# EasyEDA Pro project PCB_PCB_aire_2023-10-16.eprj

# Board PCB_PCB_aire_2023-10-16
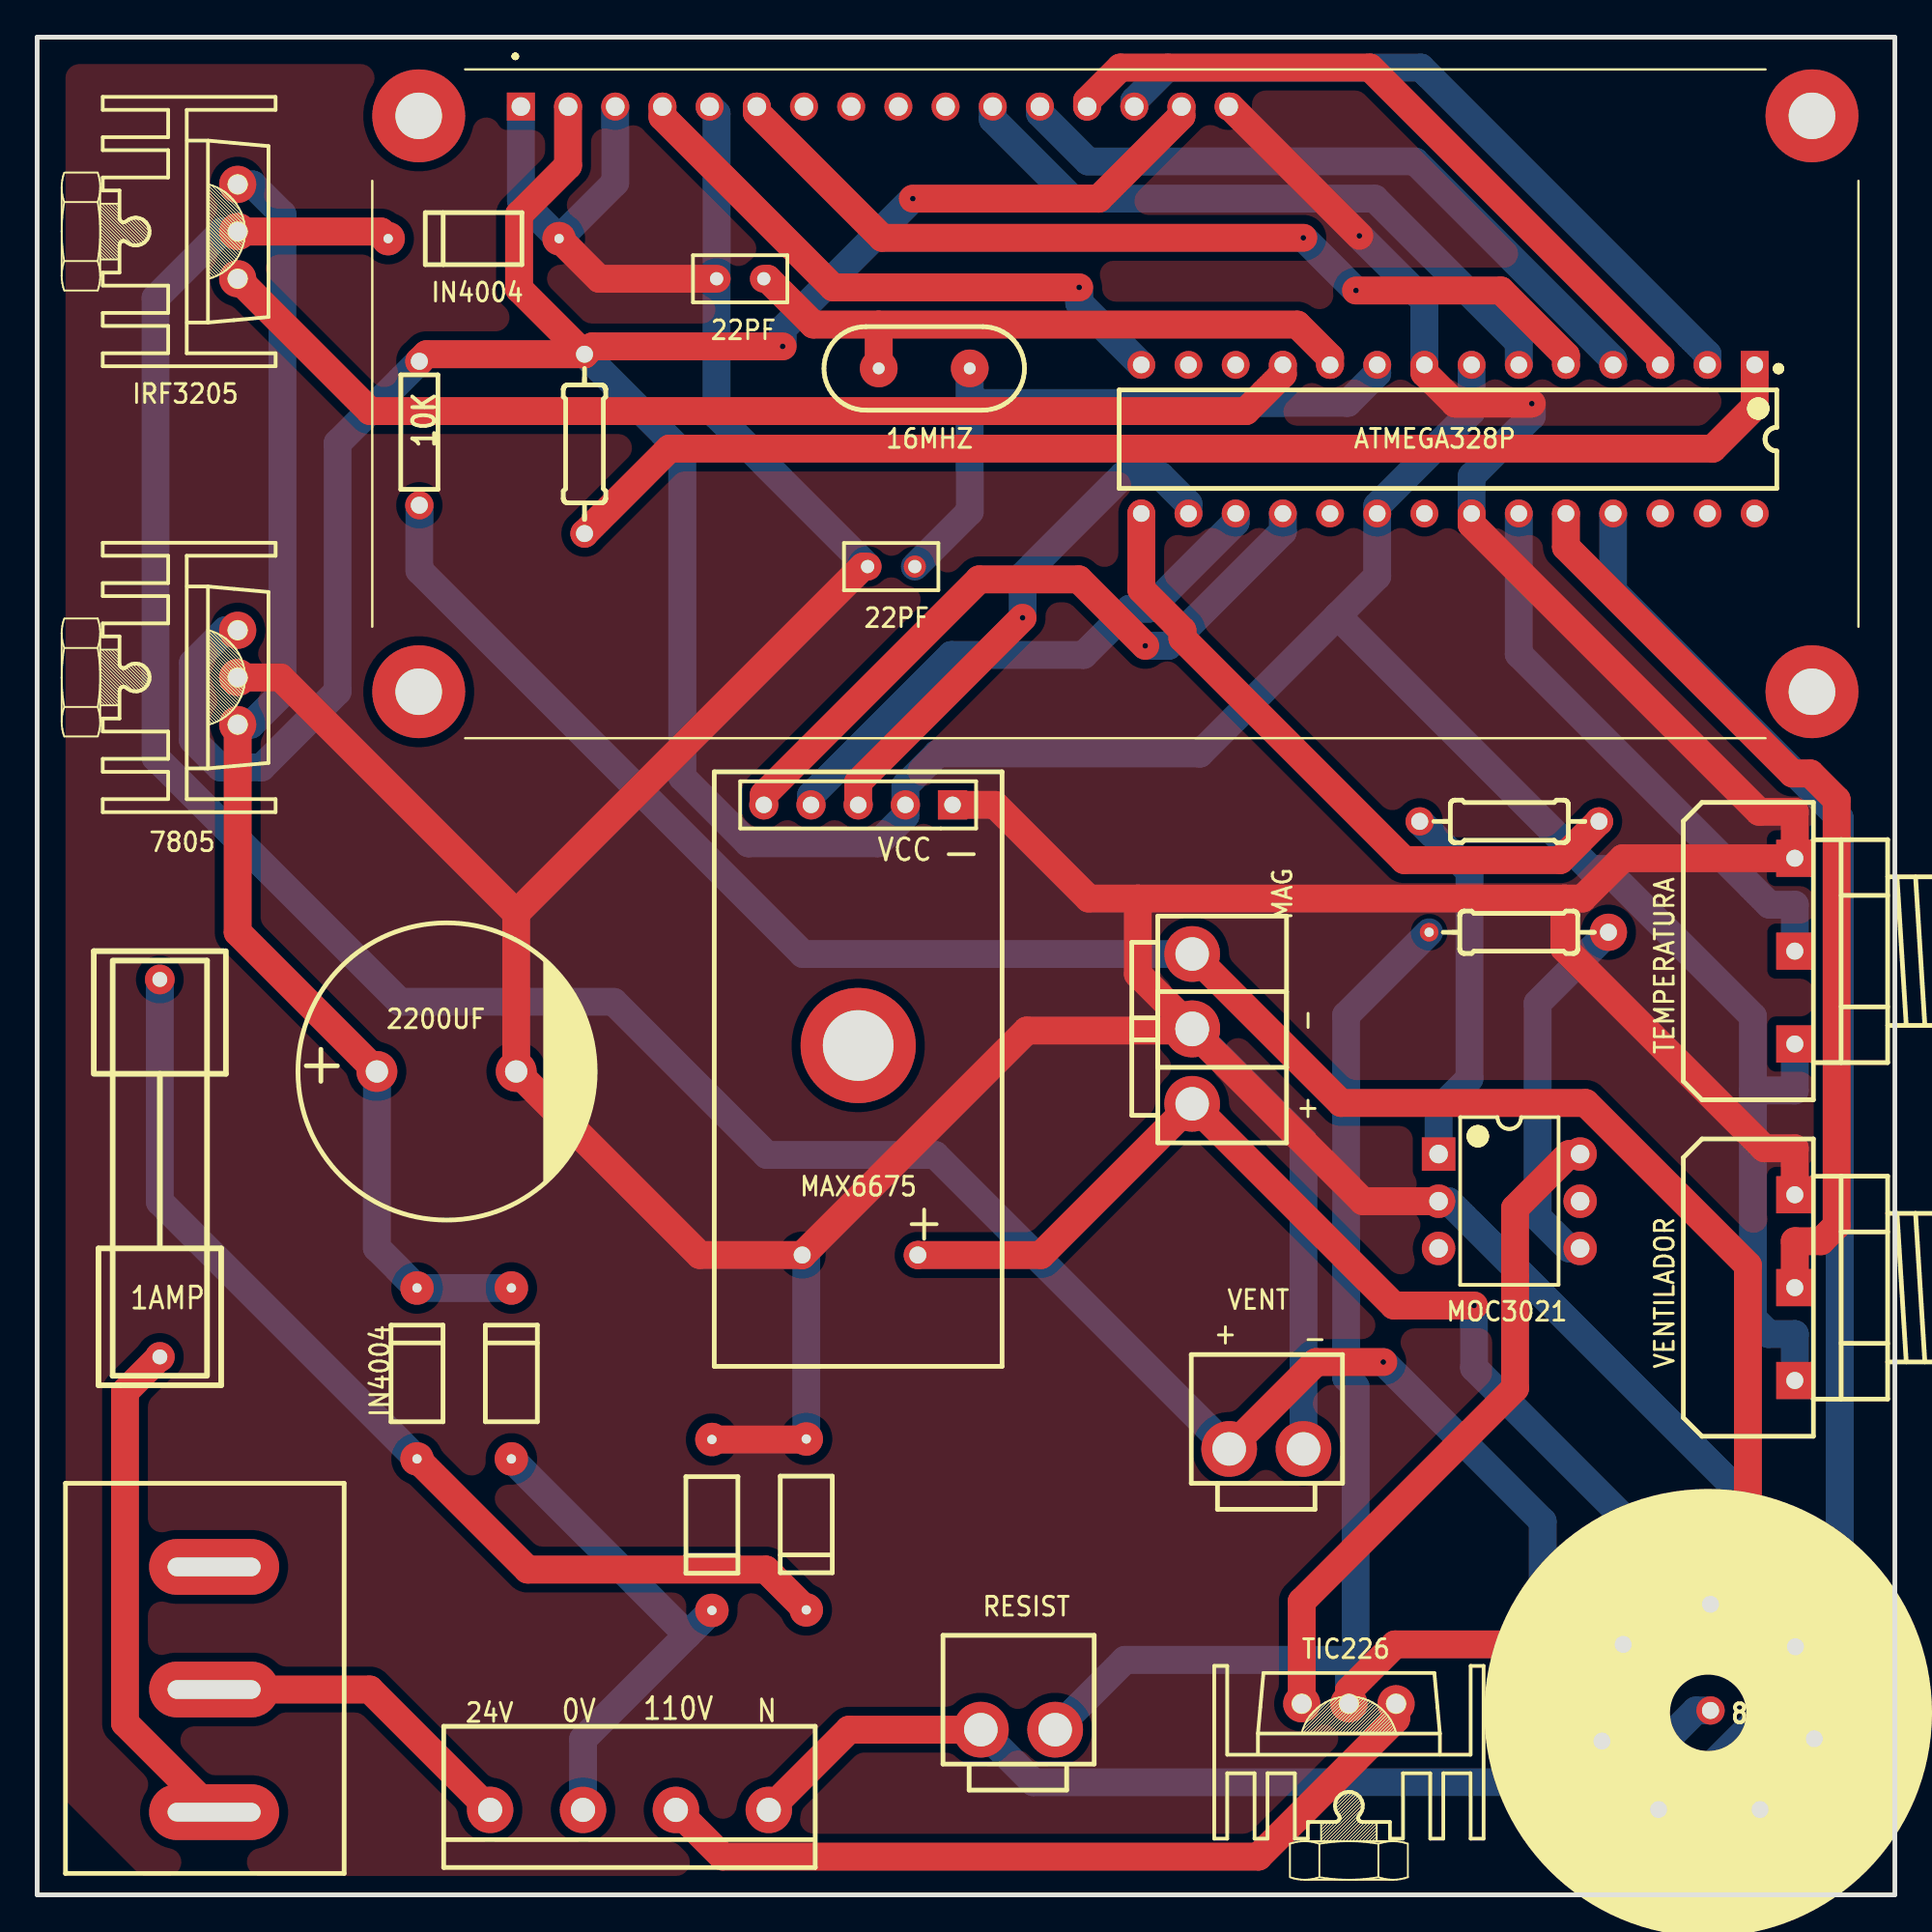
[diagram p0: board, top side]
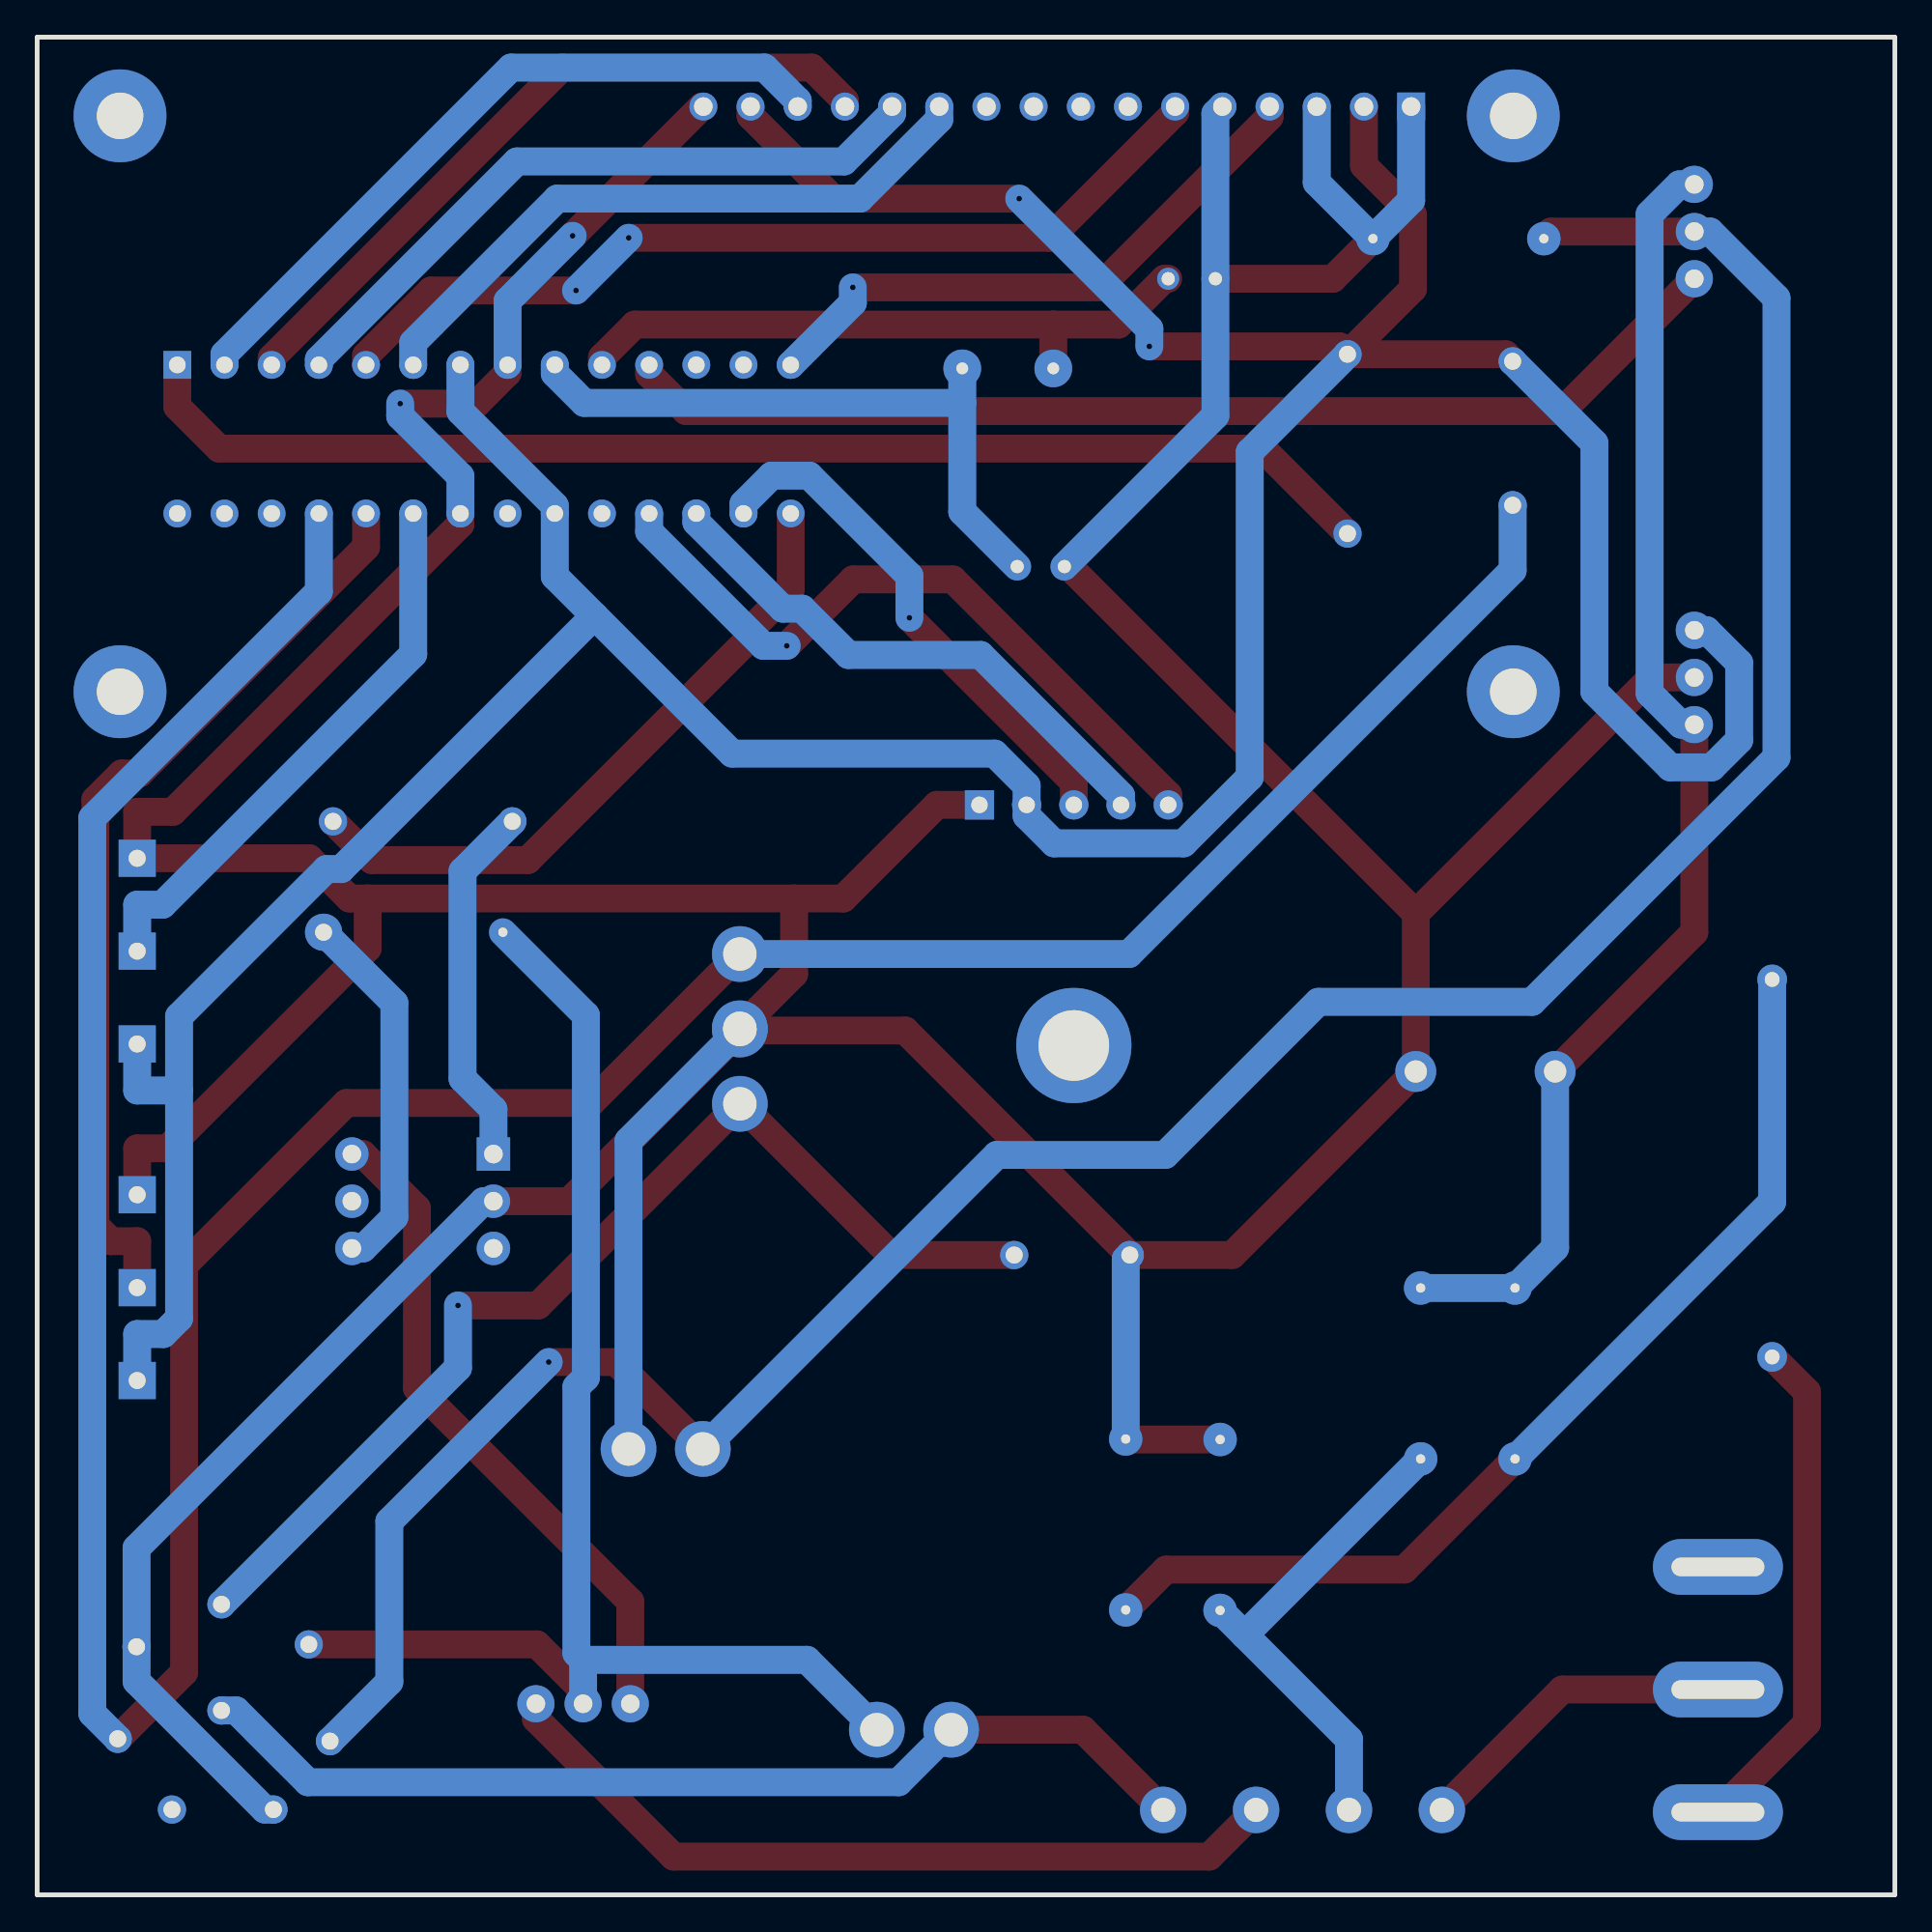
[diagram p1: board, bottom side, seen from below]

Outline 100 x 100 mm; copper layers: Top Layer, Bottom Layer. Coordinates in mm from the lower left corner of the outline.
Outline path: 0,100 100,100 100,0 0,0 0,100
Stack: Top Layer 0.035mm / Dielectric1 1.51mm FR4 er 4.5 / Bottom Layer 0.035mm

## Design rules (mm)
spacing Default (default): track to track 0.5, other pairs 0 to 0.5
track width Default (default): min 1.5, default 1.5, max 25.4
differential pair differentialPair (default): width min 0.127, default 0.254, max 2.54; gap min 0.152, default 0.152
via Default (default): diameter min 0.61, default 0.61, max 100.025; hole min 0.305, default 0.305, max 59.995

## Placement (name value [footprint] x y rotation side)
10K  -  [RESISTENCIA 10K]  20.57 78.74 270 top
16MHZ  -  [16MHZ_OSC [PCB]]  47.75 82.17 270 top
22PF  -  [RAD-0.1]  45.97 71.5 0 top
22PF#2  -  [RAD-0.1]  37.85 87 0 top
24V  -  [BORNERA 4P]  24.38 4.57 0 top
2200UF  -  [CAP-TH_BD16.0-P7.50-D1.2-FD]  22.04 44.32 0 top
7805  -  [IRF530 + DISIPADOR]  10.8 65.53 90 top
ATMEGA328P  -  [DIP-28_L34.6-W7.3-P2.54-LS10.2-BL]  75.95 78.36 180 top
D8  -  [LK D14007]  25.53 28.07 270 top
D13  -  [LK D14007]  36.32 19.91 90 top
F1  -  [PORTAFUSIBLE]  6.6 28.19 90 top
IN4004  -  [LK D14007]  20.45 28.07 270 top
IN4004#2  -  [LK D14007]  23.5 89.15 0 top
IN4005  -  [LK D14007]  41.4 19.94 90 top
IRF3205  -  [IRF530 + DISIPADOR]  10.8 89.53 90 top
MAG  -  [CONN-TH_2P-P4.00_VH2-HEADER2]  62.17 48.64 270 top
MAX6675  -  [MAX6675-MODULE]  41.66 40.89 270 top
MOC3021  -  [MOC3021-DIP6]  79.25 37.34 270 top
NOREF  -  [Pad_e623]  41.18 34.44 0 top
NOREF#2  -  [Pad_e622]  47.41 34.44 0 top
NOREF#3  -  [Pad_e624]  87.28 4.59 0 top
NOREF#4  -  [Pad_e627]  90.08 9.93 0 top
NOREF#5  -  [Pad_e629]  94.65 13.35 0 top
NOREF#6  -  [Pad_e630]  95.66 8.4 0 top
NOREF#7  -  [Pad_e631]  92.74 4.59 0 top
NOREF#8  -  [Pad_e628]  90.08 15.64 0 top
NOREF#9  -  [Pad_e626]  85.38 13.48 0 top
NOREF#10  -  [Pad_e625]  84.24 8.28 0 top
R1  -  [RESISTENCIA 220R]  79.25 57.78 0 top
R2  -  [RESISTENCIA 220R#2]  79.76 51.82 0 top
R3  -  [RESISTENCIA 220R]  29.46 78.11 270 top
RESIST  -  [CONN-TH_2P-P4.00_VH2-HEADER2]  52.8 8.89 0 top
TEMPERATURA  -  [POTENCIOMETRO10K]  94.62 45.8 90 top
TIC226  -  [IRF530 + DISIPADOR]  70.61 10.29 180 top
U16  -  [LCD_LCD2X16]  58.04 80.26 0 top
U38  -  [SWICH -SC768]  9.53 17.65 270 top
U53  -  [CONN-TH_2P-P4.00_VH2-HEADER2]  62.17 44.58 270 top
VENT  -  [CONN-TH_2P-P4.00_VH2-HEADER2]  66.17 24 0 top
VENTILADOR  -  [POTENCIOMETRO10K]  94.62 27.69 90 top

## Footprints (pads in the part's own frame, mm; a bottom-side part is the same pattern mirrored in y, then rotated)
16MHZ_OSC [PCB]
  round 2.032 hole 0.635: 1(0,2.45) 2(0,-2.45)
BORNERA 4P
  round 2.5 hole 1.3: 1(0,0) 2(5,0) 3(10,0) 4(15,0)
CAP-TH_BD16.0-P7.50-D1.2-FD
  round 2.2 hole 1.2: 1(-3.75,0) 2(3.75,0)
CONN-TH_2P-P4.00_VH2-HEADER2
  round 3 hole 1.8: 1(-2,0) 2(2,0)
DIP-28_L34.6-W7.3-P2.54-LS10.2-BL
  rect 1.5x1.5 hole 0.9: 1(-16.51,-4)
  round 1.5 hole 0.9: 2(-13.97,-4) 3(-11.43,-4) 4(-8.89,-4) 5(-6.35,-4) 6(-3.81,-4) 7(-1.27,-4) 8(1.27,-4) 9(3.81,-4) 10(6.35,-4) 11(8.89,-4) 12(11.43,-4) 13(13.97,-4) 14(16.51,-4) 15(16.51,4) 16(13.97,4) 17(11.43,4) 18(8.89,4) 19(6.35,4) 20(3.81,4) 21(1.27,4) 22(-1.27,4) 23(-3.81,4) 24(-6.35,4) 25(-8.89,4) 26(-11.43,4) 27(-13.97,4) 28(-16.51,4)
IRF530 + DISIPADOR
  round 2 hole 1: 1(-2.54,0) 2(0,0) 3(2.54,0)
LCD_LCD2X16
  rect 1.508x1.508 hole 1x1: 1(-32,16)
  round 1.508 hole 1x1: 2(-29.46,16) 3(-26.92,16) 4(-24.38,16) 5(-21.84,16) 6(-19.3,16) 7(-16.76,16) 8(-14.22,16) 9(-11.68,16) 10(-9.14,16) 11(-6.6,16) 12(-4.06,16) 13(-1.52,16) 14(1.02,16) 15(3.56,16) 16(6.1,16)
  round 5 hole 2.505x2.5: S1(-37.5,15.5) S2(37.5,15.5) S3(37.5,-15.5) S4(-37.5,-15.5)
LK D14007
  round 1.8 hole 0.5: 1(-4.6,0) 2(4.6,0)
MAX6675-MODULE
  round 6.2 hole 3.8: 0(-4.826,2.54)
  rect 1.575x1.575 hole 0.889: 1(-17.78,7.62)
  round 1.575 hole 0.889: 2(-17.78,5.08) 3(-17.78,2.54) 4(-17.78,0) 5(-17.78,-2.54)
MOC3021-DIP6
  rect 1.8x1.8 hole 1: 1(-2.54,-3.81)
  round 1.8 hole 1: 2(0,-3.81) 3(2.54,-3.81) 4(2.54,3.81) 5(0,3.81) 6(-2.54,3.81)
Pad_e622
  round 1.524 hole 0.914: 9(0,0)
Pad_e623
  round 1.524 hole 0.914: 10(0,0)
Pad_e624
  round 1.524 hole 0.914: 11(0,0)
Pad_e625
  round 1.524 hole 0.914: 12(0,0)
Pad_e626
  round 1.524 hole 0.914: 13(0,0)
Pad_e627
  round 1.524 hole 0.914: 14(0,0)
Pad_e628
  round 1.524 hole 0.914: 15(0,0)
Pad_e629
  round 1.524 hole 0.914: 16(0,0)
Pad_e630
  round 1.524 hole 0.914: 17(0,0)
Pad_e631
  round 1.524 hole 0.914: 18(0,0)
PORTAFUSIBLE
  round 1.6 hole 0.8: 1(0.762,0) 2(21.082,0)
POTENCIOMETRO10K
  rect 2x2 hole 0.914: 1(0.001,-0.001) 2(5,0) 3(10,0)
RAD-0.1
  round 1.194 hole 0.711: 1(-1.27,0) 2(1.27,0)
RESISTENCIA 10K
  round 1.524 hole 0.914: 1(-3.81,0) 2(3.937,0)
RESISTENCIA 220R
  round 1.524 hole 0.914: 1(-4.826,0) 2(4.826,0)
RESISTENCIA 220R#2
  round 1 hole 0.5: 1(-4.826,0)
  round 2 hole 0.914: 2(4.826,0)
SWICH -SC768
  oval 3x7 hole 1x5: 1(0,0) 2(6.6,0) 3(13.2,0)

## Nets
N$174904: 24V.1 U38.2
N$174911: F1.1 U38.3
N$174918: 2200UF.1 7805.1 D8.1 IN4004.1 IRF3205.3
N$174932: F1.2 IN4004.2 IN4005.1
N$174939: 24V.2 D8.2 D13.1
N$175389: IN4004#2.1 IRF3205.2 NOREF#10.12 VENT.1
N$175520: ATMEGA328P.11 IRF3205.1
N$175593: ATMEGA328P.16 MAX6675.3
N$175600: ATMEGA328P.17 MAX6675.4
N$175673: ATMEGA328P.18 MAX6675.5
N$175809: ATMEGA328P.2 U16.14
N$175816: ATMEGA328P.3 U16.13
N$175823: ATMEGA328P.4 U16.12
N$175911: ATMEGA328P.5 U16.6
N$175918: ATMEGA328P.6 U16.11
N$175925: ATMEGA328P.14 U16.4
N$175981: 10K.2 ATMEGA328P.25 MAG.1 NOREF#6.17
N$176019: 10K.1 7805.3 ATMEGA328P.7 ATMEGA328P.20 MAX6675.2 R3.1 TEMPERATURA.1 U16.2 U16.15 VENTILADOR.1
N$176591: ATMEGA328P.23 TEMPERATURA.2
N$176610: ATMEGA328P.24 VENTILADOR.2
N$177629: ATMEGA328P.15 R1.2
N$177636: MOC3021.1 R1.1
N$178015: MOC3021.4 R2.2
N$178022: NOREF#9.13 R2.1 RESIST.2 TIC226.2
N$178626: NOREF#2.9 NOREF#8.15 U53.2
N$179176: ATMEGA328P.1 R3.2
N$179702: 16MHZ.1 22PF.2 ATMEGA328P.9
N$179721: 16MHZ.2 22PF#2.2 ATMEGA328P.10
N$180133: 24V.4 NOREF#4.14 RESIST.1
N$180341: MOC3021.6 TIC226.3
N$190812: 24V.3 TIC226.1
N$194054: 22PF.1 22PF#2.1 2200UF.2 7805.2 ATMEGA328P.8 ATMEGA328P.22 D13.2 IN4004#2.2 IN4005.2 MAG.2 MAX6675.1 MOC3021.2 NOREF.10 NOREF#3.11 NOREF#5.16 TEMPERATURA.3 U16.1 U16.3 U16.5 U16.16 U53.1 VENT.2 VENTILADOR.3

Pads without a net: ATMEGA328P 12 13 19 21 26 27 28; MAX6675 0; MOC3021 3 5; NOREF#7 18; U16 7 8 9 10 S1 S2 S3 S4; U38 1

## Via types
v1: diameter 0.61, hole 0.305, Top Layer to Bottom Layer, 11 vias

## Routing (per net, layer and track width the routed paths; a pad name or vN(x,y) marks a point on that pad's centre or on a via; arc(x,y) is an arc through that point)
N$174904: length 17.5
  Top Layer w1.5: 24V.1 17.9,11.05 U38.2
N$174911: length 27.3
  Top Layer w1.5: F1.1 4.73,27.08 4.73,9.25 U38.3
N$174918: length 71.4
  Top Layer w1.5: 7805.1 10.8,51.82 2200UF.1
  Bottom Layer w1.5: 7805.1 11.51,62.99 13.2,64.68 13.2,90.47 11.6,92.08 IRF3205.3 ; D8.1 IN4004.1 18.29,34.83 2200UF.1
N$174932: length 55.9
  Top Layer w1.5: IN4004.2 26.41,17.51 39.23,17.51 IN4005.1
  Bottom Layer w1.5: F1.2 6.6,37.31 IN4004.2
N$174939: length 27
  Bottom Layer w1.5: 35,13.99 D8.2 ; 35,13.99 D13.1 ; 35,13.99 29.38,8.37 24V.2
N$175389: length 147.6
  Top Layer w1.5: IRF3205.2 18.51,89.53 IN4004#2.1 ; VENT.1 68.84,28.68 v1(72.46,28.68)
  Bottom Layer w1.5: NOREF#10.12 81.04,11.47 81.04,20.1 v1(72.46,28.68) ; VENT.1 48.34,39.83 39.28,39.83 31.04,48.07 19.53,48.07 6.37,61.23 6.37,85.96 9.95,89.53 IRF3205.2
N$175520: length 60.5
  Top Layer w1.5: ATMEGA328P.11 67.06,81.86 65.07,79.87 17.92,79.87 10.8,87
N$175593: length 28.3
  Top Layer w1.5: MAX6675.3 44.2,59.89 v1(53.05,68.74)
  Bottom Layer w1.5: ATMEGA328P.16 61.98,74.88 60.46,76.39 58.44,76.39 53.05,71 v1(53.05,68.74)
N$175600: length 29.9
  Bottom Layer w1.5: MAX6675.4 41.66,59.18 49.21,66.74 56.33,66.74 58.82,69.24 59.86,69.24 64.52,73.89 ATMEGA328P.17
N$175673: length 38.3
  Top Layer w1.5: MAX6675.5 39.12,59.22 50.71,70.81 56.07,70.81 v1(59.65,67.23)
  Bottom Layer w1.5: ATMEGA328P.18 67.06,73.38 60.91,67.23 v1(59.65,67.23)
N$175809: length 38.9
  Bottom Layer w1.5: ATMEGA328P.2 89.92,82.93 74.49,98.36 60.84,98.36 59.06,96.58 U16.14
N$175816: length 38.8
  Top Layer w1.5: 56.52,96.26 56.52,96.58 58.3,98.36 71.75,98.36 87.38,82.74 ATMEGA328P.3
N$175823: length 37
  Bottom Layer w1.5: ATMEGA328P.4 84.84,82.65 74.18,93.31 56.57,93.31 53.98,95.9 53.98,96.26
N$175911: length 49.8
  Top Layer w1.5: v1(70.99,86.36) 78.79,86.36 82.3,82.86 ATMEGA328P.5 ; v1(68.16,89.2) 45.49,89.2 38.74,95.94 38.74,96.26
  Bottom Layer w1.5: v1(70.99,86.36) v1(68.16,89.2)
N$175918: length 35.2
  Bottom Layer w1.5: ATMEGA328P.6 79.76,83.56 72,91.31 55.71,91.31 51.44,95.58 U16.11
N$175925: length 32.3
  Top Layer w1.5: v1(56.09,86.53) 42.84,86.53 33.66,95.71 U16.4
  Bottom Layer w1.5: ATMEGA328P.14 56.09,85.7 v1(56.09,86.53)
N$175981: length 189.1
  Top Layer w1.5: MAG.1 70.19,42.63 83.35,42.63 92.09,33.89 92.09,11.98 NOREF#6.17
  Bottom Layer w1.5: ATMEGA328P.25 84.84,70.16 97.03,57.96 97.03,9.77 NOREF#6.17 ; 10K.2 20.57,71.3 41.23,50.64 MAG.1
N$176019: length 242
  Top Layer w1.5: 10K.1 20.95,82.93 R3.1 ; v1(47.14,91.31) 57.14,91.31 61.6,95.76 U16.15 ; R3.1 29.89,83.35 v1(40.13,83.35) ; R3.1 25.94,86.45 25.94,90.45 28.58,93.09 28.58,96.26
  Bottom Layer w1.5: 7805.3 10.13,68.07 8.38,66.32 8.38,62.16 9.85,60.69 12.09,60.69 16.17,64.78 16.17,78.15 10K.1 ; v1(40.13,83.35) 40.13,84.3 v1(47.14,91.31) ; 70,68.85 72.14,70.98 ATMEGA328P.20 72.14,74.78 77.22,79.86 ATMEGA328P.7 ; 70,68.85 83.63,55.22 84.43,55.22 92.36,47.29 92.36,43.3 ; 70,68.85 62.59,61.43 48.46,61.43 46.74,59.71 MAX6675.2 46.74,58.09 45.25,56.6 38.29,56.6 34.73,60.17 34.73,77.67 R3.1 ; TEMPERATURA.1 94.62,43.3 92.36,43.3 ; VENTILADOR.1 94.62,30.19 93.21,30.19 92.36,31.03 92.36,43.3
N$176591: length 30.5
  Bottom Layer w1.5: ATMEGA328P.23 79.76,66.79 93.25,53.3 94.62,53.3 TEMPERATURA.2
N$176610: length 50
  Top Layer w1.5: ATMEGA328P.24 82.3,72.56 94.49,60.36 95.45,60.36 96.87,58.95 96.87,36.03 96.02,35.19 94.62,35.19 VENTILADOR.2
N$177629: length 35.9
  Top Layer w1.5: ATMEGA328P.15 59.44,70.28 61.65,68.06 61.65,67.64 73.59,55.7 81.99,55.7 R1.2
N$177636: length 19.7
  Bottom Layer w1.5: MOC3021.1 75.44,42.28 77.1,43.94 77.1,55.1 R1.1
N$178015: length 19.9
  Bottom Layer w1.5: R2.2 80.77,48 80.77,36.49 82.46,34.8 MOC3021.4
N$178022: length 77.6
  Top Layer w1.5: TIC226.2 70.61,11 73.1,13.48 NOREF#9.13
  Bottom Layer w1.5: 70.61,12.65 TIC226.2 ; 70.61,12.65 58.56,12.65 RESIST.2 ; 70.61,12.65 70.97,13.01 70.97,27.34 70.46,27.85 70.46,47.35 R2.1
N$178626: length 59.2
  Top Layer w1.5: NOREF#2.9 54.03,34.44 U53.2 73.03,31.73 v1(77.35,31.73)
  Bottom Layer w1.5: v1(77.35,31.73) 77.35,28.37 NOREF#8.15
N$179176: length 68.1
  Top Layer w1.5: ATMEGA328P.1 92.46,80.11 90.2,77.85 34.04,77.85 R3.2
N$179702: length 34.9
  Bottom Layer w1.5: 50.2,80.31 50.2,74.46 22PF.2 ; 50.2,80.31 70.55,80.31 72.14,81.9 ATMEGA328P.9 ; 50.2,80.31 16MHZ.1
N$179721: length 35
  Top Layer w1.5: 45.3,84.53 67.83,84.53 69.6,82.76 ATMEGA328P.10 ; 45.3,84.53 41.79,84.53 39.32,87 22PF#2.2 ; 45.3,84.53 16MHZ.2
N$180133: length 55.3
  Top Layer w1.5: 24V.4 43.7,8.89 RESIST.1
  Bottom Layer w1.5: NOREF#4.14 89.29,9.93 85.43,6.06 53.63,6.06 RESIST.1
N$180341: length 36.1
  Top Layer w1.5: TIC226.3 68.07,15.79 79.56,27.28 79.56,36.96 82.47,39.88 MOC3021.6
N$190812: length 43.7
  Top Layer w1.5: TIC226.1 73.15,9.47 65.74,2.06 36.9,2.06 24V.3
N$194054: length 394.5
  Top Layer w1.5: 82.21,53.63 83.19,53.63 85.35,55.8 TEMPERATURA.3 94.62,58.3 92.69,58.3 77.22,73.78 ATMEGA328P.22 ; 82.21,53.63 59.25,53.63 ; 82.21,53.63 82.21,50.95 92.97,40.19 94.62,40.19 VENTILADOR.3 ; 59.25,53.63 56.6,53.63 51.56,58.67 MAX6675.1 ; 59.25,53.63 59.25,49.57 MAG.2 ; 62.17,46.53 71.36,37.34 MOC3021.2 ; 62.17,46.53 U53.1 ; 62.17,46.53 53.27,46.53 NOREF.10 35.67,34.44 2200UF.2 25.79,52.84 ; 7805.2 13.1,65.53 25.79,52.84 ; ATMEGA328P.8 74.68,81.93 76.33,80.27 v1(80.46,80.27) ; 25.79,52.84 44.45,71.5 22PF.1 ; IN4005.2 41.37,24.51 D13.2 ; IN4004#2.2 30.25,87 22PF#2.1 ; v1(71.18,89.31) 64.22,96.26 64.14,96.26
  Bottom Layer w1.5: VENT.2 68.17,40.59 U53.1 MAG.2 ; 36.2,96.26 36.58,95.89 22PF#2.1 36.58,79.63 22PF.1 ; 26.04,96.26 26.04,91.21 IN4004#2.2 31.12,92.18 31.12,96.26 ; NOREF.10 41.4,34.22 IN4005.2 ; v1(71.18,89.31) 74.68,85.81 ATMEGA328P.8 ; v1(80.46,80.27) 80.46,79.6 77.22,76.36 ATMEGA328P.22 ; NOREF#3.11 87.74,4.59 94.65,11.5 NOREF#5.16 94.65,18.66 75.98,37.34 MOC3021.2

## Copper pours and planes (outline as drawn; the poured copper is in the pictures)
N$194054 on Top Layer: 1.65,98.55 97.92,98.55 98.3,98.17 98.3,3.68 95.63,1.02 5.59,1.02 1.52,5.08 1.52,98.42

## Text on the board
Top Silkscreen Layer: 6 | 5 | 7 | 8 | 1 | 4 | 3 | 2 | N | + | - | 10K | 1AMP | 0V | 110V | VCC
